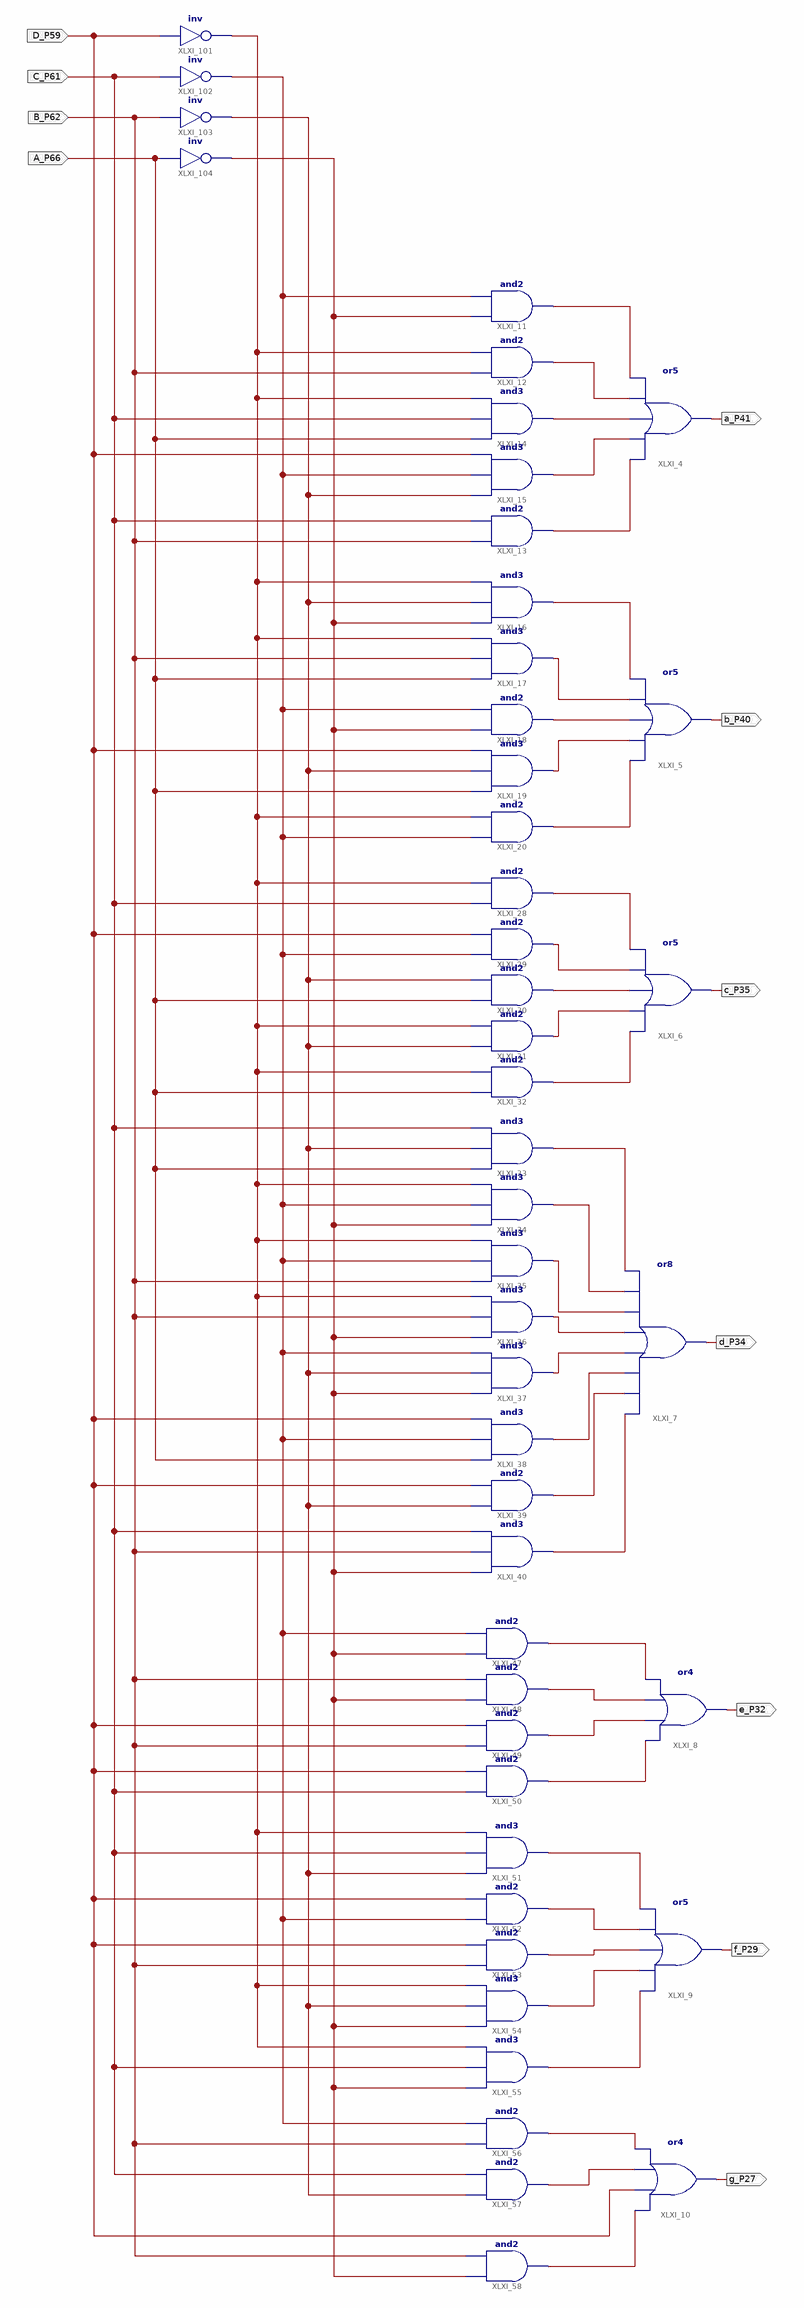
[diagram p0: schematic sheet 1]
// Xilinx ISE schematic seven_seg_0toF.sch (spartan6) as structural Verilog: 46 symbols, 11 ports
module seven_seg_0toF (
  input  D_P59,
  input  C_P61,
  input  B_P62,
  input  A_P66,
  output a_P41,
  output b_P40,
  output c_P35,
  output d_P34,
  output e_P32,
  output f_P29,
  output g_P27
);

  wire XLXN_1, XLXN_2, XLXN_3, XLXN_4, XLXN_5, XLXN_14, XLXN_15, XLXN_16, XLXN_17, XLXN_18, XLXN_20, XLXN_21,
       XLXN_22, XLXN_23, XLXN_24, XLXN_25, XLXN_26, XLXN_27, XLXN_28, XLXN_29, XLXN_30, XLXN_31, XLXN_32,
       XLXN_46, XLXN_47, XLXN_49, XLXN_50, XLXN_51, XLXN_52, XLXN_53, XLXN_54, XLXN_55, XLXN_56, XLXN_57,
       XLXN_58, XLXN_177, XLXN_191, XLXN_203, XLXN_213;

  and XLXI_11 (XLXN_1, XLXN_213, XLXN_191);
  and XLXI_12 (XLXN_2, B_P62, XLXN_177);
  and XLXI_14 (XLXN_3, A_P66, C_P61, XLXN_177);
  and XLXI_15 (XLXN_4, XLXN_203, XLXN_191, D_P59);
  and XLXI_13 (XLXN_5, B_P62, C_P61);
  or XLXI_4 (a_P41, XLXN_5, XLXN_4, XLXN_3, XLXN_2, XLXN_1);
  and XLXI_16 (XLXN_14, XLXN_213, XLXN_203, XLXN_177);
  and XLXI_17 (XLXN_15, A_P66, B_P62, XLXN_177);
  and XLXI_18 (XLXN_16, XLXN_213, XLXN_191);
  and XLXI_19 (XLXN_17, A_P66, XLXN_203, D_P59);
  and XLXI_20 (XLXN_18, XLXN_191, XLXN_177);
  and XLXI_28 (XLXN_20, C_P61, XLXN_177);
  and XLXI_29 (XLXN_21, XLXN_191, D_P59);
  and XLXI_30 (XLXN_22, A_P66, XLXN_203);
  and XLXI_31 (XLXN_23, XLXN_203, XLXN_177);
  and XLXI_32 (XLXN_24, A_P66, XLXN_177);
  and XLXI_33 (XLXN_25, A_P66, XLXN_203, C_P61);
  and XLXI_34 (XLXN_26, XLXN_213, XLXN_191, XLXN_177);
  and XLXI_35 (XLXN_27, B_P62, XLXN_191, XLXN_177);
  and XLXI_36 (XLXN_28, XLXN_213, B_P62, XLXN_177);
  and XLXI_37 (XLXN_29, XLXN_213, XLXN_203, XLXN_191);
  and XLXI_38 (XLXN_30, A_P66, XLXN_191, D_P59);
  and XLXI_39 (XLXN_31, XLXN_203, D_P59);
  and XLXI_40 (XLXN_32, XLXN_213, B_P62, C_P61);
  or XLXI_9 (f_P29, XLXN_55, XLXN_54, XLXN_53, XLXN_52, XLXN_51);
  or XLXI_5 (b_P40, XLXN_18, XLXN_17, XLXN_16, XLXN_15, XLXN_14);
  or XLXI_6 (c_P35, XLXN_24, XLXN_23, XLXN_22, XLXN_21, XLXN_20);
  or XLXI_7 (d_P34, XLXN_32, XLXN_31, XLXN_30, XLXN_29, XLXN_28, XLXN_27, XLXN_26, XLXN_25);
  and XLXI_47 (XLXN_46, XLXN_213, XLXN_191);
  and XLXI_48 (XLXN_47, XLXN_213, B_P62);
  and XLXI_49 (XLXN_49, B_P62, D_P59);
  and XLXI_50 (XLXN_50, C_P61, D_P59);
  or XLXI_8 (e_P32, XLXN_50, XLXN_49, XLXN_47, XLXN_46);
  and XLXI_51 (XLXN_51, XLXN_203, C_P61, XLXN_177);
  and XLXI_52 (XLXN_52, XLXN_191, D_P59);
  and XLXI_53 (XLXN_53, B_P62, D_P59);
  and XLXI_54 (XLXN_54, XLXN_213, XLXN_203, XLXN_177);
  and XLXI_55 (XLXN_55, XLXN_213, C_P61, XLXN_177);
  and XLXI_56 (XLXN_56, B_P62, XLXN_191);
  and XLXI_57 (XLXN_57, XLXN_203, C_P61);
  and XLXI_58 (XLXN_58, XLXN_213, B_P62);
  or XLXI_10 (g_P27, XLXN_58, D_P59, XLXN_57, XLXN_56);
  not XLXI_101 (XLXN_177, D_P59);
  not XLXI_102 (XLXN_191, C_P61);
  not XLXI_103 (XLXN_203, B_P62);
  not XLXI_104 (XLXN_213, A_P66);
endmodule
